# EAGLE board main (EAGLE 6.1)
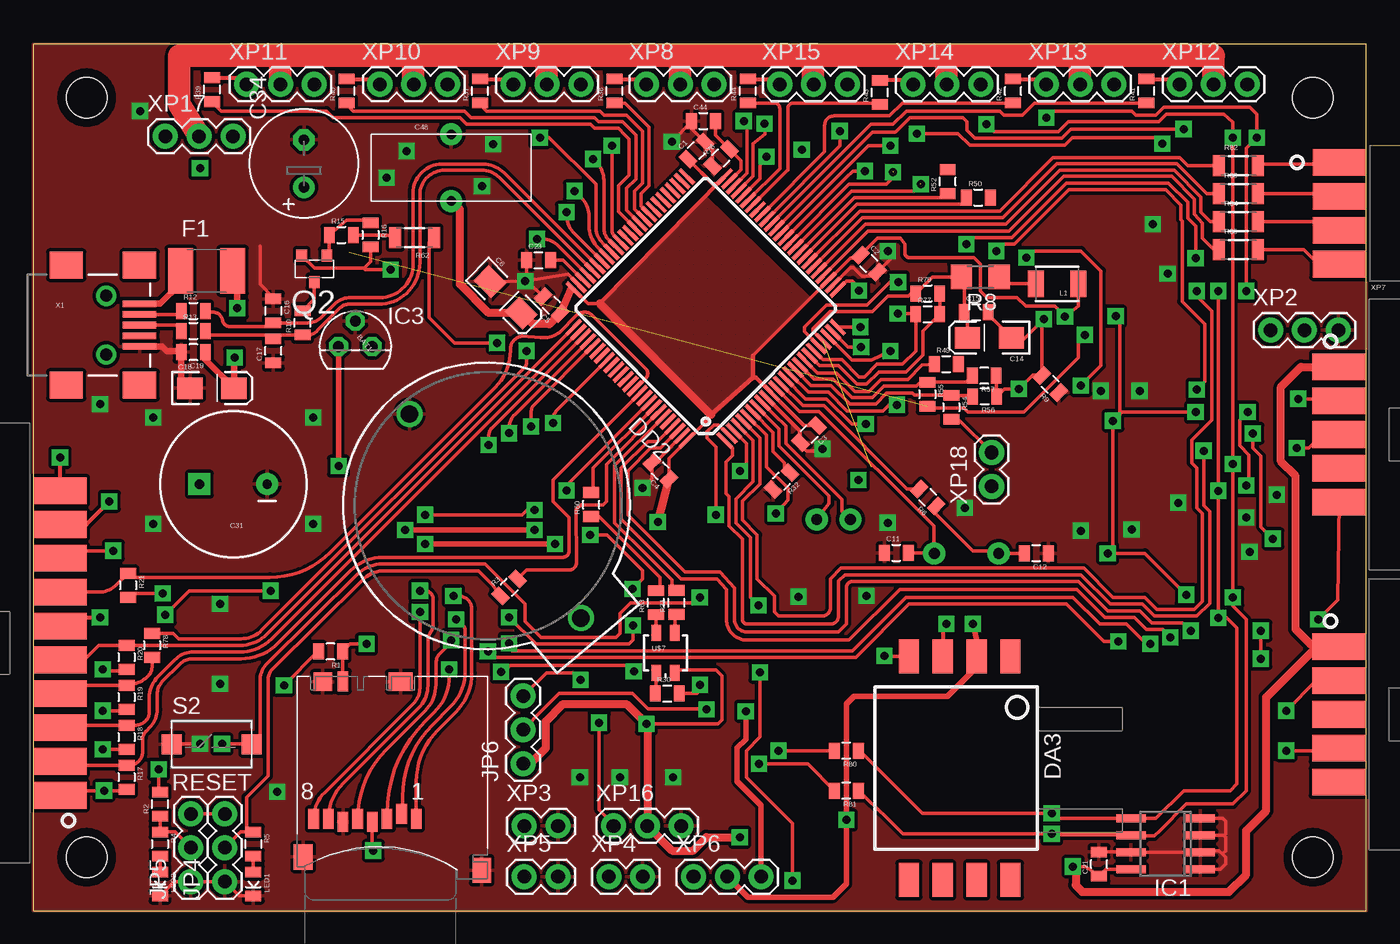
[diagram p3: board, top side]
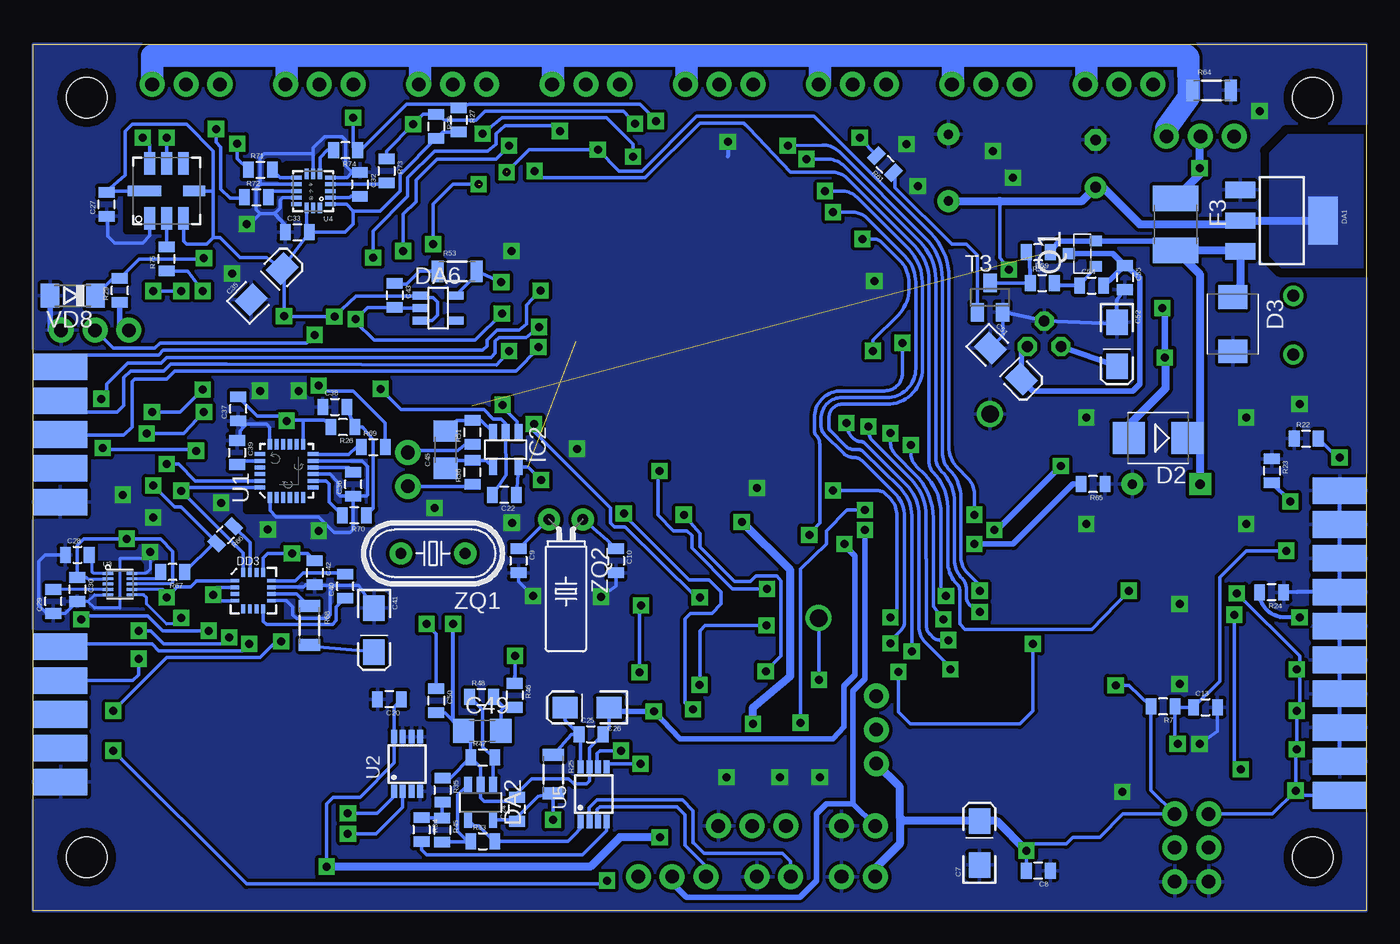
[diagram p4: board, bottom side, seen from below]

Size 100 x 65 mm. Coordinates in mm from the lower left corner, seen from the top.
Outline: 0,0 100,0 100,65 0,65 0,0
Copper layers (1*16): Top 0.035mm / dielectric 1.5mm / Bottom 0.035mm
Design rules "default": minimum track width 0.5mm, minimum drill 0.3mm, track to track 0.18mm, track to pad 0.15mm, pad to pad 0.15mm, via to via 0.15mm, smd to smd 0.15mm, copper to edge 0mil, drill to drill 30mil, minimum pad ring 12mil, minimum via ring 12mil, stop-mask expansion 4mil, vias tented up to drill 0mil, thermal gap 10mil
tKeepout: area 75.5,10 to 89.7,18.5
bRestrict: area 77,52 to 81,56; area 87,51 to 93,57; area 78,30 to 84,36; area 81.5,22 to 85.5,26; area 92,23 to 95,26; 6 lines

## Footprints (pad centres in the part's own frame; a part is rotated, then mirrored left to right if it is on the bottom)
BATTCOM_20MM_PTH = drill 1.3: 1 20,0; 2 0,0
0805 = smd 0.8 x 1.2: 1 -0.9,0; 2 0.9,0
EIA3216-KIT = smd 1.9 x 1.6: A 1.65,0; C -1.65,0
CPOL-RADIAL-1000UF-25V = drill 0.7 pad 1.651 square: 1 2.54,0 | drill 0.7 pad 1.651: 2 -2.54,0
E3,5-8 = drill 0.813 pad 1.6: + -1.778,0 | drill 0.813 pad 1.6 octagon: - 1.778,0
1206 = smd 1.6 x 1.8: 1 -1.4,0; 2 1.4,0
CAP-IONISTOR-5MM = drill 0.7 pad 1.651: 1 -2.5,0; 2 2.5,0
C1206 = smd 1.6 x 1.8: 1 -1.4,0; 2 1.4,0
SMB = smd 2.4 x 2.4: A 2.2,0; C -2.2,0
SMBJ = smd 1.78 x 2.16: A 2.04,0; C -2.03,0
SOT223 = smd 1.219 x 2.235: 1 -2.311,-3.099; 2 0,-3.099; 3 2.311,-3.099 | smd 3.6 x 2.2: 4 0,3.099
SOT23-5 = smd 0.6 x 1.2: 1 -0.95,-1.306; 2 0,-1.306; 3 0.95,-1.306; 4 0.95,1.306; 5 -0.95,1.306
482 = smd 2.54 x 1.524: 1 -7.62,3.81; 2 -7.62,1.27; 3 -7.62,-1.27; 4 -7.62,-3.81; 5 9.144,-3.81; 6 9.144,-1.27; 7 9.144,1.27; 8 9.144,3.81
MICROSD = smd 0.8 x 1.5: 1 -1.94,2.7; 2 -0.84,2.3; 3 0.26,2.7; 4 1.36,2.9; 5 2.46,2.7; 6 3.56,2.9; 7 4.66,2.7; 8 5.76,2.7; 13 3.56,-7.641 | smd 1.4 x 1.9: 9 6.55,5.55; 10 -6.85,6.55 | smd 1.8 x 1.4: 11 -0.75,-7.6 | smd 1.4 x 1.4: 12 5.077,-7.6
TQFP100 = smd 1.5 x 0.3: 1 -8,6; 2 -8,5.5; 3 -8,5; 4 -8,4.5; 5 -8,4; 6 -8,3.5; 7 -8,3; 8 -8,2.5; 9 -8,2; 10 -8,1.5; 11 -8,1; 12 -8,0.5; 13 -8,0; 14 -8,-0.5; 15 -8,-1; 16 -8,-1.5; 17 -8,-2; 18 -8,-2.5; 19 -8,-3; 20 -8,-3.5; 21 -8,-4; 22 -8,-4.5; 23 -8,-5; 24 -8,-5.5; 25 -8,-6; 51 8,-6; 52 8,-5.5; 53 8,-5; 54 8,-4.5; 55 8,-4; 56 8,-3.5; 57 8,-3; 58 8,-2.5; 59 8,-2; 60 8,-1.5; 61 8,-1; 62 8,-0.5; 63 8,0; 64 8,0.5; 65 8,1; 66 8,1.5; 67 8,2; 68 8,2.5; 69 8,3; 70 8,3.5; 71 8,4; 72 8,4.5; 73 8,5; 74 8,5.5; 75 8,6 | smd 0.3 x 1.5: 26 -6,-8; 27 -5.5,-8; 28 -5,-8; 29 -4.5,-8; 30 -4,-8; 31 -3.5,-8; 32 -3,-8; 33 -2.5,-8; 34 -2,-8; 35 -1.5,-8; 36 -1,-8; 37 -0.5,-8; 38 0,-8; 39 0.5,-8; 40 1,-8; 41 1.5,-8; 42 2,-8; 43 2.5,-8; 44 3,-8; 45 3.5,-8; 46 4,-8; 47 4.5,-8; 48 5,-8; 49 5.5,-8; 50 6,-8; 76 6,8; 77 5.5,8; 78 5,8; 79 4.5,8; 80 4,8; 81 3.5,8; 82 3,8; 83 2.5,8; 84 2,8; 85 1.5,8; 86 1,8; 87 0.5,8; 88 0,8; 89 -0.5,8; 90 -1,8; 91 -1.5,8; 92 -2,8; 93 -2.5,8; 94 -3,8; 95 -3.5,8; 96 -4,8; 97 -4.5,8; 98 -5,8; 99 -5.5,8; 100 -6,8
16LPCC = smd 0.65 x 0.28: 1 -1.37,0.75; 2 -1.37,0.25; 3 -1.37,-0.25; 4 -1.37,-0.75; 9 1.37,-0.75; 10 1.37,-0.25; 11 1.37,0.25; 12 1.37,0.75 | smd 0.28 x 0.65: 5 -0.75,-1.37; 6 -0.25,-1.37; 7 0.25,-1.37; 8 0.75,-1.37; 13 0.75,1.37; 14 0.25,1.37; 15 -0.25,1.37; 16 -0.75,1.37
1812 = smd 1.9 x 3.4: 1 -1.95,0; 2 1.95,0
SO-08 = smd 0.6 x 2.2: 1 -1.905,-2.6; 2 -0.635,-2.6; 3 0.635,-2.6; 4 1.905,-2.6; 5 1.905,2.6; 6 0.635,2.6; 7 -0.635,2.6; 8 -1.905,2.6
TO92 = drill 0.813 octagon: 1 -1.27,0; 2 0,1.905; 3 1.27,0
2X5-PSEUDOSMD = smd 4 x 2: 1 0,5.08; 3 0,2.54; 5 0,0; 7 0,-2.54; 9 0,-5.08 | smd 4 x 2 bottom: 2 0,5.08; 4 0,2.54; 6 0,0; 8 0,-2.54; 10 0,-5.08
STAND-OFF-TIGHT = hole 3.048: 0,0
1X03 = drill 1.016 pad 1.88: 1 0,0; 2 2.54,0; 3 5.08,0
1210 = smd 1.2 x 2: 1 -1.6,0; 2 1.6,0
LED-0805 = smd 0.8 x 1.2: A -0.9,0; C 0.9,0
MICRO3 = smd 0.8 x 0.9: 1 -0.95,-1; 2 0.95,-1; 3 0,1
R1206 = smd 1.6 x 1.803: 1 -1.422,0; 2 1.422,0
R1206' = smd 0.9 x 1.6: 1 -1.45,0; 2 1.45,0
BUTTON_6X3.5 = smd 1.5 x 1.5: P 0,-1.75; S 6,-1.75
SOT23 = smd 1 x 1.4: 1 -0.95,-1.1; 2 0.95,-1.1; 3 0,1.1
QFN-24 = smd 0.8 x 0.3: 1 -2,1.25; 2 -2,0.75; 3 -2,0.25; 4 -2,-0.25; 5 -2,-0.75; 6 -2,-1.25; 13 2,-1.25; 14 2,-0.75; 15 2,-0.25; 16 2,0.25; 17 2,0.75; 18 2,1.25 | smd 0.3 x 0.8: 7 -1.25,-2; 8 -0.75,-2; 9 -0.25,-2; 10 0.25,-2; 11 0.75,-2; 12 1.25,-2; 19 1.25,2; 20 0.75,2; 21 0.25,2; 22 -0.25,2; 23 -0.75,2; 24 -1.25,2
MSOP8 = smd 1 x 0.45: 1 -2.05,0.975; 2 -2.05,0.325; 3 -2.05,-0.325; 4 -2.05,-0.975; 5 2.05,-0.975; 6 2.05,-0.325; 7 2.05,0.325; 8 2.05,0.975
DFN-10 = smd 0.8 x 0.22: 1 -0.91,0.8; 2 -0.91,0.4; 3 -0.91,0; 4 -0.91,-0.4; 5 -0.91,-0.8; 6 0.91,-0.8; 7 0.91,-0.4; 8 0.91,0; 9 0.91,0.4; 10 0.91,0.8
QFN-16_0.5MM = smd 0.8 x 0.3: 1 -1.275,1; 2 -1.275,0.5; 3 -1.275,0; 4 -1.275,-0.5; 5 -1.275,-1; 9 1.275,-1; 10 1.275,-0.5; 11 1.275,0; 12 1.275,0.5; 13 1.275,1 | smd 0.3 x 0.8: 6 -0.5,-1.275; 7 0,-1.275; 8 0.5,-1.275; 14 0.5,1.275; 15 0,1.275; 16 -0.5,1.275
BMP085 = smd 1.67 x 0.8: 1 -2.065,1.27; 2 -2.065,0; 3 -2.065,-1.27; 5 2.065,-1.27; 6 2.065,0; 7 2.065,1.27 | smd 0.8 x 1.67: 4 0,-2.065 | smd 0.8 x 2.5: 8 0,1.65
LED-TRICOLOR-SMD = smd 0.7 x 1.2: A 0.7,-1.5; B 0.7,1.5; G -0.7,1.5; R -0.7,-1.5
SOD80C = smd 1.4 x 1.8: A 1.7,0; C -1.7,0
USB-MINIB-NOSTOP = smd 2.5 x 0.5: D+ 2.5,0; D- 2.5,0.8; GND 2.5,-1.6; ID 2.5,-0.8; VBUS 2.5,1.6 | smd 2.5 x 2: G1 -3,-4.5; G2 -3,4.5; G3 2.5,4.5; G4 2.5,-4.5 | drill 0.9 pad 0.8: H1 0,2.2 | drill 0.9 pad 0.787: H2 0,-2.2
2X10-PSEUDOSMD = smd 4 x 2: 1 0,11.43; 3 0,8.89; 5 0,6.35; 7 0,3.81; 9 0,1.27; 11 0,-1.27; 13 0,-3.81; 15 0,-6.35; 17 0,-8.89; 19 0,-11.43 | smd 4 x 2 bottom: 2 0,11.43; 4 0,8.89; 6 0,6.35; 8 0,3.81; 10 0,1.27; 12 0,-1.27; 14 0,-3.81; 16 0,-6.35; 18 0,-8.89; 20 0,-11.43
1X02 = drill 1.016 pad 1.88: 1 0,0; 2 2.54,0
1X4-PSEUDOSMD = smd 4 x 2: 1 -3.81,5.08; 2 -3.81,2.54; 3 -3.81,0; 4 -3.81,-2.54
HC49U-V = drill 0.813 pad 1.676: 1 -2.413,0; 2 2.413,0
TC38H = drill 0.813 pad 1.676: 1 -1.27,0; 2 1.27,0

## Placement (x,y rotation side)
BAT1  3V  [BATTCOM_20MM_PTH]  28.22,37.26 310 top
C1  0.1uF  [0805]  49.75,57.02 45 top
C2  0.1uF  [0805]  62.69,48.55 315 top
C3  0.1uF  [0805]  58.2,35.75 225 top
C4  0.1uF  [0805]  47.05,33 135 top
C5  0.1uF  [0805]  38.87,45.43 135 top
C6  10uF/6.3v  [EIA3216-KIT]  35.42,46.01 315 top
C7  47uF/6.3v  [EIA3216-KIT]  29.01,5.07 90 bottom
C8  0.1uF  [0805]  24.6,3 180 bottom
C9  10pF  [0805]  63.6,26.25 270 bottom
C10  10pF  [0805]  56.3,26.25 270 bottom
C11  20pF  [0805]  64.75,26.85 0 top
C12  20pF  [0805]  75.25,26.8 180 top
C13  0.1uF  [0805]  12.05,15.25 0 bottom
C14  10uF/6.3v  [EIA3216-KIT]  71.73,42.98 180 top
C15  0.1uF  [0805]  70.74,44.89 0 top
C16  20pF  [0805]  18,45 270 top
C17  20pF  [0805]  18,42 90 top
C18  10uF/6.3v  [EIA3216-KIT]  13.4,39.2 0 top
C19  0.1uF  [0805]  12,41.9 180 top
C20  0.1uF  [0805]  73.28,15.85 180 bottom
C21  0.1uF  [0805]  79.96,3.5 90 top
C22  0.1uF  [0805]  64.65,31.2 180 bottom
C23  2.2uF  [0805]  37.9,48.8 0 top
C24  0.1uF  [0805]  63.71,7.6 90 bottom
C25  0.1uF  [0805]  58.16,13.23 0 bottom
C26  4.7uF  [EIA3216-KIT]  58.46,15.23 180 bottom
C27  0.1uF  [0805]  94.5,53 90 bottom
C28  0.1uF  [0805]  96.7,26.7 0 bottom
C29  0.1uF  [0805]  98.5,23.2 90 bottom
C30  1uF  [0805]  96.7,24.1 270 bottom
C31  330uF/16v  [CPOL-RADIAL-1000UF-25V]  15,32 180 top
C32  0.1uF  [0805]  75.5,54.5 270 bottom
C33  0.1uF  [0805]  80.2,50.9 0 bottom
C34  560uF/4v  [E3,5-8]  20.3,56.05 90 top
C35  4.7uF  [EIA3216-KIT]  82.5,47 45 bottom
C36  0.1uF  [0805]  76,32 90 bottom
C37  0.1uF  [0805]  84.63,37.65 90 bottom
C38  0.1uF  [0805]  77.38,37.8 0 bottom
C39  2.2nF/50v  [0805]  84.72,34.37 270 bottom
C40  0.22uF  [0805]  76.6,24.34 90 bottom
C41  4.7uF  [EIA3216-KIT]  74.44,21.04 270 bottom
C42  0.1uF  [0805]  78.88,25.36 270 bottom
C43  0.1uF  [0805]  72.88,46.16 270 bottom
C44  2.2uF  [0805]  50.28,59.24 0 top
C45  10uF  [1206]  69.06,34.58 90 bottom
C48  0.22F/5.5v  [CAP-IONISTOR-5MM]  31.35,55.75 90 top
C49  2.2uF  [C1206]  66.32,13.47 0 bottom
C50  0.1uF  [0805]  69.77,15.74 270 bottom
C51  10uF/16v  [EIA3216-KIT]  27.02,41.05 315 bottom
C52  10uF/6.3v  [EIA3216-KIT]  18.7,42.5 270 bottom
C54  0.1uF  [0805]  20.6,46.9 0 bottom
C55  0.1uF  [0805]  18.1,47.5 270 bottom
D2  10BQ060  [SMB]  15.62,35.46 180 bottom
D3  SM6T12V  [SMBJ]  10,44 270 bottom
DA1  LM1117  [SOT223]  6.34,51.77 270 bottom
DA2  LMV321M5  [SOT23-5]  66.44,8.12 180 bottom
DA3  MPXV5010DP  [482]  69.5,11.44 270 top
DA6  LP2980  [SOT23-5]  69.63,45.21 270 bottom
DD1  MICROSD_SDIO  [MICROSD]  26.79,9.57 180 top
DD2  STM32F103VDT6  [TQFP100]  50.45,45.18 135 top
DD3  HMC5883L  [16LPCC]  83.5,24 0 bottom
F1  POLYSWITCH  [1812]  13,48 0 top
F3  POLYSWITCH  [1812]  14.3,51.5 270 bottom
IC1  24AA32ASN  [SO-08]  84.96,5 90 top
IC2  INA194  [SOT23-5]  64.56,34.58 180 bottom
IC3  LP2950Z  [TO92]  24.16,42.32 0 top
JP1  2X5  [2X5-PSEUDOSMD]  97.97,35.72 0 top
JP2  2X5  [2X5-PSEUDOSMD]  97.95,14.72 0 top
JP3  STAND-OFFTIGHT  [STAND-OFF-TIGHT]  4,4 0 top
JP4  boot_0  [1X03]  14.36,2.17 90 top
JP5  boot_1  [1X03]  11.82,2.17 90 top
JP6  bat  [1X03]  36.75,11.02 90 top
JP7  STAND-OFFTIGHT  [STAND-OFF-TIGHT]  96,61 0 top
JP8  STAND-OFFTIGHT  [STAND-OFF-TIGHT]  96,4 0 top
JP9  STAND-OFFTIGHT  [STAND-OFF-TIGHT]  4,61 0 top
L1  1uH  [1210]  76.8,47.03 180 top
LED1  RED  [LED-0805]  16.5,2 270 top
LED2  RED  [LED-0805]  9.5,2 270 top
Q1  IRLML5203  [MICRO3]  21.3,49.3 90 bottom
Q2  IRLML5103  [MICRO3]  21.08,48.16 180 top
R1  10k  [0805]  22.3,19.43 180 top
R2  10k  [0805]  9.5,8 90 top
R3  10k  [0805]  35.7,24.25 45 top
R4  100  [0805]  9.5,5 270 top
R5  100  [0805]  16.5,5 270 top
R6  330  [0805]  67.1,31 135 top
R7  10k  [0805]  15.25,15.3 180 bottom
R8  2.2  [R1206]  71.05,47.55 180 top
R9  0  [0805]  76.3,39.5 135 top
R10  1.5k  [0805]  20.2,44.1 90 top
R12  33  [0805]  12,45 0 top
R13  33  [0805]  12,43.5 0 top
R15  2.7k  [0805]  23.1,50.7 0 top
R16  10k  [0805]  25.3,50.7 270 top
R17  10k  [0805]  7,10 270 top
R18  10k  [0805]  7,13 270 top
R19  10k  [0805]  7,16 270 top
R20  10k  [0805]  7,19 270 top
R21  10k  [0805]  7.1,24.4 270 top
R22  10k  [0805]  4.5,35.42 0 bottom
R23  10k  [0805]  7.08,33 270 bottom
R24  10k  [0805]  7.1,23.88 180 bottom
R25  2.2  [R1206']  60.99,10.23 270 bottom
R26  1  [0805]  76.78,36.28 180 bottom
R27  2.7k  [0805]  68.08,59.32 270 bottom
R28  2.7k  [0805]  69.78,58.85 270 bottom
R29  1k  [0805]  93.52,46.53 90 bottom
R30  68  [0805]  47.55,16.29 0 top
R31  0  [0805]  48.25,23.12 90 top
R32  100k  [0805]  56.13,32.22 225 top
R33  100k  [0805]  66.28,5.2 0 bottom
R34  30k  [0805]  70.87,6.07 270 bottom
R35  1.5k  [0805]  69.3,9.03 270 bottom
R36  47  [0805]  67.06,32.88 90 bottom
R37  330  [0805]  33.5,61.5 90 top
R38  330  [0805]  43.6,61.5 90 top
R39  330  [0805]  13.4,61.6 90 top
R40  330  [0805]  23.5,61.5 90 top
R41  330  [0805]  83.5,61.5 90 top
R42  330  [0805]  73.5,61.5 90 top
R43  330  [0805]  63.5,61.4 90 top
R44  330  [0805]  53.6,61.5 90 top
R45  10k  [0805]  69.32,6.04 270 bottom
R46  1k  [0805]  63.88,16.15 270 bottom
R47  100k  [0805]  66.28,11.48 0 bottom
R48  10k  [0805]  66.37,16.03 0 bottom
R49  330  [0805]  68.5,41 0 top
R50  330  [0805]  70.9,53.5 0 top
R51  47  [0805]  67.06,35.88 90 bottom
R52  330  [0805]  68.6,54.7 90 top
R53  2.2  [R1206']  68.21,47.97 0 bottom
R54  10k  [0805]  68.87,37.76 270 top
R55  10k  [0805]  67.07,38.74 270 top
R56  1k  [0805]  71.37,38.58 180 top
R57  1k  [0805]  71.35,40.13 180 top
R58  1k  [0805]  24.3,47.1 0 bottom
R59  10k  [0805]  24.6,49.4 180 bottom
R60  0  [0805]  41.85,30.46 90 top
R61  1k  [0805]  36.1,56 135 bottom
R62  0  [R1206']  28.6,50.5 180 top
R63  68  [0805]  46.7,23.1 90 top
R64  0  [R1206']  11.6,61.55 0 bottom
R65  0  [0805]  20.5,32 180 bottom
R66  1k  [0805]  85.6,28.2 225 bottom
R67  1k  [0805]  89.55,25.4 180 bottom
R68  0  [R1206']  79.29,21.39 270 bottom
R69  1k  [0805]  74.5,34.77 0 bottom
R70  0  [0805]  75.9,29.65 180 bottom
R71  1k  [0805]  82.96,55.59 0 bottom
R72  1k  [0805]  83.27,53.52 0 bottom
R73  0  [0805]  73.5,55.5 270 bottom
R74  0  [0805]  76.57,57.04 180 bottom
R75  1k  [0805]  90,48.9 90 bottom
R76  0  [0805]  51.59,56.49 45 top
R77  0  [0805]  67.1,44.75 0 top
R78  0  [0805]  8.9,19.9 270 top
R79  0  [0805]  67.1,46.3 0 top
R80  0  [0805]  61,12 180 top
R81  0  [0805]  61,9 180 top
R82  0  [R1206']  90.4,55.9 0 top
R83  0  [R1206']  90.4,53.8 0 top
R84  0  [R1206']  90.4,51.7 0 top
R85  0  [R1206']  90.4,49.6 0 top
S2  RESET  [BUTTON_6X3.5]  10.39,14.23 0 top
T3  BC848  [SOT23]  28.22,46 0 bottom
U1  ITG-3200  [QFN-24]  81,33 90 bottom
U2  TMP75DGK  [MSOP8]  71.96,11 90 bottom
U3  MAG3110  [DFN-10]  93.5,24.5 0 bottom
U4  MMA8451Q  [QFN-16_0.5MM]  79,54 180 bottom
U5  MAX1236EUA+  [MSOP8]  57.96,8.73 90 bottom
U44  BMP085  [BMP085]  90,54 90 bottom
U$7  LED-TRICOLOR  [LED-TRICOLOR-SMD]  47.43,19.33 0 top
VD8  BZV55-C3V3  [SOD80C]  97.04,46.13 180 bottom
X1  USB-SMD-NS  [USB-MINIB-NOSTOP]  5.47,43.93 0 top
XP1  2X10-PSEUDO_SMD  [2X10-PSEUDOSMD]  2,20.08 180 top
XP2  RECEIVER  [1X03]  92.83,43.55 0 top
XP3  EXT_5V  [1X02]  36.83,6.35 0 top
XP4  an2_5v  [1X02]  43.18,2.54 0 top
XP5  EXT3.3V  [1X02]  36.83,2.54 0 top
XP6  sonar  [1X03]  49.53,2.54 0 top
XP7  SPI_EXT  [1X4-PSEUDOSMD]  101.8,51.05 0 top
XP8  PWM1  [1X03]  46,62 0 top
XP9  PWM2  [1X03]  36,62 0 top
XP10  PWM3  [1X03]  26,62 0 top
XP11  PWM4  [1X03]  16,62 0 top
XP12  PWM5  [1X03]  86,62 0 top
XP13  PWM6  [1X03]  76,62 0 top
XP14  PWM7  [1X03]  66,62 0 top
XP15  PWM8  [1X03]  56,62 0 top
XP16  tacho  [1X03]  43.53,6.35 0 top
XP17  power  [1X03]  9.9,58.1 0 top
XP18  current_sens  [1X02]  71.9,31.83 90 top
ZQ1  8M  [HC49U-V]  70.01,26.8 180 bottom
ZQ2  32k  [TC38H]  60.04,29.35 180 bottom

## Tracks (layer width: path | path; a pad name or v marks a point on that pad's centre or on a via)
3.3V  (via drill 0.6)
  Top 0.25: IC1.8 80.45,3.1 C21.1 | 25.43,4.57 DD1.4 | DD2.75 | 46.07,13.93 v46,14 51.35,14 51.65,14.3 51.65,17.6 51.2,18.05 48.35,18.05 U$7.A | v46.85,29.15 47,29 | JP6.1 36.75,11.25
  Top 0.254: JP5.3 JP4.3 | R17.2 6.9,9 v5.3,9 2.35,9 XP1.2 | v5.2,12.1 R18.2 | R19.2 7,15 v5.2,15 | R20.2 7,18 5.3,18 v5.2,18.1 | v9.7,23.8 7.3,23.8 R21.2 | 50.5,36.74 DD2.100 47.69,33.93 C4.1 | 54,41.66 DD2.28 59.66,47.3 61.32,48.96 61.83,48.96 C2.1 63.32,50.45 65.05,50.45 65.4,50 65.4,49.32 arc90 65.72,49 70.55,49 71.05,48.5 71.05,46.5 71.55,46 73.8,46 74.45,45.35 76.64,45.35 v77.41,44.58 78.4,45.37 L1.1 | C3.1 58.84,36.26 | R1.2 21.33,19.43 v18.8,16.9 | C1.1 50.16,55.34 | v93,27.9 92.1,28.8 92.1,34.1 91.5,34.7 v91.5,35.8 | 81,36.7 81,27.2 v80.6,26.8 83.4,26.8 v86.5,23.7 | C21.1 78.96,3.3 v78,3.3 | 42.51,45.55 41.6,45.55 DD2.75 | 81,36.7 v81,36.75 81.65,37.4 v87.2,37.4 | 81,36.7 81.5,37.2 81.5,44.3 v81.2,44.6 | Q2.2 21.09,48.2 24.8,48.2 | 24.8,48.2 24.9,48.1 v26.8,48.1 | R16.2 25.3,48.7 24.8,48.2
  Top 0.3: 54.22,40 DD2.11
  Top 0.305: DD2.11 57.78,36.44 C3.1 | 50.16,55.34 51,54.5 51.28,54.5 DD2.50 42.51,45.57
  Top 0.35: 50.5,36.74 50.85,37.2 50.8,37.2 54,40 | 42.51,45.55 42.51,45.57 | 54,40 54.22,40 | 54,40 54,41.66 | DD2.75 40.31,46.59
  Top 0.406: v25.5,4.5 25.43,4.57
  Top 0.61: 50.85,37.2 42.51,45.55 | 40.31,46.59 C5.1 38.71,44 37.5,44 36.66,44.84 C6.A 34.16,44.84 32,47 32,52.6 C48.1 | 46.07,13.93 XP16.2 47.92,4.5 49.5,4.5 50.5,5.5 v53,5.5 | v46.85,29.15 C4.1 | v46,14 44.5,15.5 39.75,15.5 38.45,14.2 38.45,12.2 37.27,11.02 JP6.1 | v78,3.3 78.2,3.3 78.2,1.9 78.7,1.4 89.7,1.4 91,2.7 91,6 92.5,7.5 92.5,16 96.3,19.8 JP2.1 97.7,20 95.8,20 94.7,21.1 94.7,32.6 93.6,33.7 93.6,39.3 95.1,40.8 JP1.1
  Bottom 0.22: U3.2 95.9,24.9 96,25 C30.1 | U3.8 89.7,24.5 89.55,24.65
  Bottom 0.25: DD3.13 82.75,26.45 82.42,26.78 | 79.4,26.78 C42.1 | DD3.2 86.25,24.25 86.5,24 v86.5,23.7 | 86.5,23.5 86.25,23.25 DD3.4 | U4.14 79.5,51.1 C33.2 76.6,50.9 76,51.5 76,52.5 76.5,53 U4.1 | U44.8 94.4,54 arc-90 C27.2 94.5,54 93.1,55.2 93.1,58.5 92.6,59 88.5,59 86.5,57 86.5,54 | U44.3 88.73,50.23 88.5,50 87,50 86.5,50.5 86.5,54 | 86.5,54 U44.4 | C8.2 v25.5,4.5 25.43,4.57 | C30.1 96.7,27.4 96.2,27.9 v93,27.9 90.44,27.9 89.55,26.93 89.55,24.65 | 25.43,4.57 25.43,5 | 25.43,4.57 25,5 22.5,5 22,5.5 20,5.5 18.25,7.25 JP4.3 16.15,9.04 R7.2 17.79,16.9 v18.8,16.9
  Bottom 0.254: JP5.3 7.05,7.25 v5.3,9 | v5.3,9 5.3,12 v5.2,12.1 v5.2,15 5,15 5,17.9 v5.2,18.1 5.1,18.1 5,18 5,19.1 v9.7,23.8 | XP1.2 4.95,8.65 v5.3,9 | R27.2 69.31,58.42 R28.2 72.5,55.23 72.5,54 74,52.5 76,52.5 | C35.A 79.3,50.87 C33.2 | C35.A 82.5,49 84.5,49 86,50.5 86.5,50.5 | 79.75,36.8 U1.13 | R26.2 78.2,36.8 79.75,36.8 | DA6.3 70.09,44.26 69.65,44.7 69.65,45.65 70,46 70.78,46 DA6.1 70.9,46.1 75.8,46.1 v77.41,44.59 v77.41,44.58 80.78,44.58 v81.2,44.6 81.2,48.03 C35.A | 79.75,36.8 80.95,36.8 v81,36.75 81.35,37.1 83.2,37.1 84.63,38.53 C37.2 | v26.8,48.1 27.5,49 27.5,53.25 | 79.4,26.78 79.42,26.8 v80.6,26.8 82.4,26.8 82.42,26.78 | v86.5,23.7 86.5,23.5 | C20.1 72.94,15.29 U2.8 72.94,11.06 75.5,8.5 77.5,8.5 78,8 v78,3.3 | v91.5,35.8 88.7,35.8 v87.2,37.4
  Bottom 0.61: DA1.4 DA1.2 9.71,51.5 17,51.5 19.77,54.27 C34.+ 21.32,53.25 27.5,53.25 C48.1 | v46.85,29.15 43.2,25.55 43.2,17.6 46,15.25 v46,14 | v78,3.3 58.2,3.3 56,5.5 v53,5.5 | JP6.1 35,9.27 35,7 | 35,7 35,5 36.83,3.17 XP5.1 | v25.5,4.5 27.72,6.72 C7.A 34.72,6.72 35,7
  pour Bottom (no thermals, hatched): 0,58.5 6,58.5 7.5,57 7.5,49 6.5,48 0,48
  pour Top (hatched): 42.4,45.4 50.5,53.4 58.1,46 54,42 54,40 50.8,37.1
5V  (via drill 0.6)
  Top 0.406: v70.5,21.5 71,19.29 DA3.2 71,18.83 71,18.5 68.57,16.07 61.57,16.07 61,15.5 v61,6.8 61,2 60,1 53.61,1 XP6.2 | IC3.1 22.89,36.11 22.9,36.1 v22.9,33.35 | v37.6,28.55 v27.9,28.55
  Bottom 0.25: 62.13,8.58 R25.2 61,8.57 v61,6.8
  Bottom 0.254: DA2.5 63.82,6.81 C24.1 63.71,7 62.13,8.58 | C50.1 69.77,20.77 v70.5,21.5
  Bottom 0.406: IC3.1 C52.A | XP6.2 52.07,2.07 51,1 42.5,1 41.25,2.25 41.25,7.25 40.5,8 38.52,8 38.5,8.02 | v22.9,33.35 27.7,28.55 v27.9,28.55 | v37.6,28.55 37.6,17.4 38.5,16.5 38.5,8.02 | XP3.1 38.5,8.02
5V_DOMAIN_ENABLE  (via drill 0.6)
  Top 0.25: DD2.67 42.74,50.06 arc-45 42.2,51.36 42.2,54.5 38.7,58 v38,58
  Bottom 0.25: v38,58 R61.2
5V_USB  (via drill 0.6)
  Top 0.25: v15.3,45.2 15.5,45
  Top 0.5: C19.1 12.9,41.35 C18.A 15.05,41.45 v15.1,41.5 | F1.2 15.3,48 v15.3,45.2
  Bottom 0.5: v15.3,45.2 15.1,45 v15.1,41.5
  Bottom 0.61: D2.A 17.82,36.43 C18.A 15.05,41.45 v15.1,41.5
6V  (via drill 0.6)  (1 unrouted)
  Top 0.254: v78.9,43.2 78.4,42.7 78.4,41.5 74.3,37.4 70.1,37.4 69.8,37.7 67.21,37.7 R55.2
  Bottom 0.254: XP2.2 94.02,42.2 90.9,42.2 90.5,42.6 79.5,42.6 v78.9,43.2
  Bottom 0.406: F3.2 15,50.25 Q1.2 23.05,50.25 R59.1
  Bottom 0.61: 10.05,49.55 F3.2 12.46,47.71 12.46,35 | DA1.3 9.44,46.59 | C31.1 12.46,35 | D2.C 12.92,35.46 12.46,35
  Bottom 1.016: 10.05,49.55 DA1.3 | 9.44,46.59 D3.C
AN5V_0
  Bottom 0.25: 59.4,5.7 58.94,6.17 U5.1
  Bottom 0.254: DA2.4 66.93,6.35 66.6,6.35 65.45,5.2 R33.2 59.9,5.2 59.4,5.7
AN5V_1
  Bottom 0.25: U5.2 58.3,6.7 58.3,7.7 57.7,8.3 56.4,8.3 | XP4.1 43.18,3.68 43.8,4.3 49.7,4.3 50.4,5
  Bottom 0.254: 56.4,8.3 51.3,8.3 50.5,7.5 50.5,5.1 50.4,5
AN5V_2
  Bottom 0.25: U5.3 57.7,6.75 57.7,7.6 57.5,7.8 56.7,7.8 | 50.7,4.5 49.53,3.33 XP6.1
  Bottom 0.254: 56.7,7.8 51.7,7.8 51.1,7.2 51.1,4.9 50.7,4.5
AN5V_3/REF
  Bottom 0.254: R34.2 70.87,4.57 70.5,4.2 58.8,4.2 57,6 57,6.67 U5.4 56.95,6.64
BMP085_EOC  (via drill 0.6)
  Top 0.25: 54.3,24.9 54.3,28.2 53.2,29.3 53.2,30.72 54.5,32.02 54.5,35.47 DD2.5
  Top 0.254: DD2.5 53.28,36.67 | 54.3,24.9 55.6,23.6 55.6,22.4 55.9,22.1 59.18,22.1 arc90 59.8,22.72 59.8,24.89 60.61,25.7 78.8,25.7 81,23.5 83.4,23.5 84.3,22.6 87.1,22.6 87.7,23.2 87.7,29.8 87.3,30.2 87.3,33.2 86.9,33.6 86.9,35.3 88.4,36.8 88.4,45 87.3,46.1 v87.3,46.5
  Bottom 0.254: R75.1 88.4,48 v87.3,46.5
BOOT_0
  Top 0.25: 43,33.49 43,30.71 42.73,30.43 41.3,30.45 41.1,30.45 40.73,30.09 40.75,26.12 arc-90 40.18,25.55 37,25.55 R3.2
  Top 0.254: 43,33.49 DD2.94
BOOT_1  (via drill 0.6)
  Top 0.25: v17.8,24 11.7,24 v9.9,22.2 | v9.4,10.6 9.4,9 R2.2 | DD2.37 60.98,55 61.48,55.5 v62.4,55.5
  Top 0.254: DD2.37 56.48,50.48
  Bottom 0.25: 46.7,59.1 46.32,58.7 43.2,55.4 39.99,55.4 arc45 38.98,54.98 33.87,49.87 arc45 32.8,47.28 32.8,33.65 arc-45 32.48,32.88 arc45 31.4,30.27 31.4,26.22 arc-45 30.68,24.48 arc45 30.5,24.05 30.5,21.5 30.1,21.1 20.6,21.1 v17.8,24 | v9.9,22.2 9.9,11.2 v9.4,10.6 | 54.1,55 62.4,55 v62.4,55.5
  Bottom 0.254: 54.1,55 50,59.1 46.72,59.1 46.32,58.7
CURRENT_SENS  (via drill 0.6)
  Top 0.25: 59.65,38.9 58.14,38.9 DD2.15
  Top 0.254: DD2.15 56.87,40.23 56.87,40.18 | 59.65,38.9 61.05,37.5 63.75,37.5 64.2,37.95 v64.8,37.95
  Bottom 0.254: IC2.1 63.7,35.98 63.7,36.7 64.8,37.8 v64.8,37.95
FROM_GPS  (via drill 0.6)
  Top 0.25: v40,52.4 40,52.23 arc45 40.6,50.79 DD2.69
  Top 0.254: v83.8,20 83.5,20 82,21.5 80,21.5 78,23.5 65.45,23.5 61.45,19.5 35.9,19.5 v35.7,20.05
  Bottom 0.25: 33.8,47.16 arc-45 34.61,49.11 37.48,51.98 arc-45 38.49,52.4 v40,52.4
  Bottom 0.254: 97.7,20 JP2.2 96.5,19.8 96.3,20 91.1,20 90.6,19.5 84.3,19.5 v83.8,20 | v35.7,20.05 35.55,20.4 34.88,21.07 arc-45 34.65,21.62 34.65,29.57 arc-45 35.38,31.33 37.76,33.71 arc-45 38.47,34 38.48,34 arc45 39.19,34.29 40.64,35.74 arc45 40.9,36.37 40.9,36.94 arc90 39.34,38.5 35.96,38.5 arc-90 33.8,40.66 33.8,47.16
FROM_XBEE  (via drill 0.6)
  Top 0.254: DD2.26 61.01,47.25 61.46,47.25 61.95,46.76 v61.95,46.53
  Bottom 0.254: v61.95,46.53 62.58,45.9 62.58,45.87 63,45.45 63,44 63.55,43.55 65.2,43.55 65.95,42.8 65.95,42.35 66.3,42.05 90.25,42.05 90.6,41.7 96.97,41.7 97.07,41.6 | 97.07,41.6 96.1,41.6 | 97.07,41.6 97.44,41.23 JP1.2
GND  (via drill 0.6)
  Top 0.25: C21.2 82.33,4.4 IC1.7 IC1.2 87.69,4.5 88.96,4.5 89.21,4.25 | IC1.1 89.06,3.1 89.46,3.5 89.46,4 89.21,4.25 | 89.33,5.63 IC1.3 | 89.33,5.63 89.46,5.5 89.46,4.5 89.21,4.25 | IC1.4 89.25,6.91 89.45,6.7 89.45,5.76 89.33,5.63 | S2.P 10.41,12.5 v12.5,12.5 | v36.91,47.24 40.11,47.74 DD2.74
  Top 0.254: LED1.C 15.43,1.1 JP4.1 JP5.1 10.57,2.17 LED2.C | C16.1 18,46 17,47 17,49.85 | DD2.27 61.29,48.23 61.54,48.23 62.18,47.59 63,47.59 C2.2 64.38,48.97 v64.11,49.47 | C4.2 46.64,33.64 | v45.7,31.71 46.41,32.42 C4.2 | DD2.99 46.68,33.64 C4.2 | C23.1 37,47.33 v36.91,47.24 | C5.2 37.06,47.24 v36.91,47.24 | C6.C v36.91,47.24 | 47.9,57.76 v47.9,57.7 49.38,59.18 | 49.38,59.18 C44.1 | 49.38,59.18 49.38,58.66 C1.2 50.95,57.09 R76.1 | C3.2 57.56,34.94 58,34.5 59.06,34.5 v59.21,34.65
  Top 0.305: DD2.10 57.51,35.99 C3.2 | DD2.74
  Top 0.5: X1.GND 9.67,42.33 10,42 11,42 C19.2 11.1,39.85 C18.C
  Bottom 0.22: U3.5 95.4,23.7 95.9,23.2 | 95.9,23.2 C30.2 | U3.10 91.6,25.3 arc-34 91.24,25.62 v91.25,26.9 91.3,26.45 93.5,26.45 93.5,22.7 95.4,22.7 95.9,23.2
  Bottom 0.25: DD3.11 82.11,24.27 79.71,24.27 79.52,24.46 C42.2 78.82,24.4 77.75,24.4 | DD3.9 81.02,23.26 80.53,22.77 80.53,22.2 80.26,21.93 78.01,21.93 77.75,22.19 77.75,24.4 | U1.18 82.26,35.03 | U1.9 77.75,32.75 77.17,32.17 77.17,31.29 76.98,31.1 C36.1 | U1.11 75.35,33.75 74.93,33.33 | C36.1 75.73,31.1 | 82.23,30.98 U1.1 82.25,30.02 81.78,29.55 78.61,29.55 77.44,28.38 76.22,28.38 76,28.6 C36.1 | 81.2,51 C33.1 | C32.1 76.07,55.4 76.57,55.9 76.57,57.8 76.85,58.08 78.16,58.08 79,57.24 79,56.8 U4.7 | v12.5,12.5 11.15,13.45 C13.2 | v62.5,23.6 63.3,24.4 | C10.2 56.3,24.35 v57.4,23.55 | 75.6,24.4 77.75,24.4 | 97.6,22.3 C29.1 99,22.3 | 99.6,22.9 99.6,24.8
  Bottom 0.254: C51.C 27.27,43.13 T3.2 | C9.2 63.6,24.7 63.3,24.4 | 74.93,33.33 74.93,31.17 75,31.1 C36.1 | U4.5 76.47,55 76.07,55.4 | U4.12 81.3,53.5 81.5,53.3 81.5,52.7 81.9,52.3 83,52.3 | 83,52.3 83.3,52.6 83.3,54.2 83,54.5 | 83,54.5 83,56.5 82.7,56.8 79,56.8 | 83,54.5 U4.10 | 81.2,51.5 81.2,51 | C33.1 81.1,50.55 | 83,52.3 84.17,51.13 | 99.6,24.8 99.6,26.2 99.1,26.7 C28.1 | 99,22.3 99.6,22.9 | C30.2 97.6,22.3 | 82.26,35.03 82.26,36.26 82.5,36.5 84,36.5 84.25,36.25 | C39.1 84.5,35.49 84.5,36 84.25,36.25 | C41.C 75.6,24.4 | C37.1 84.63,36.63 84.25,36.25 | C27.1 94.4,52.1 94.4,50.6 93.9,50.1 91.8,50.1 91.27,50.63 U44.1
  Bottom 0.3: IC3.2 T3.2
  Bottom 0.305: IC3.2 18.82,44.02 C52.C 18.7,45.8 C55.2 | XP1.4 XP1.6 XP1.8 XP1.10 XP1.12 XP1.14 | XP1.20 XP1.18 XP1.16 XP1.14 | R24.1 5.19,23.89 XP1.14 | v47.9,57.7 47.9,56.6 | 81.9,52.3 81.2,51.5
  Bottom 0.406: XP2.3 98.74,43.55 VD8.A
  other vias: 8,60 33.65,54.35 34.5,57.5 28,57 26.5,55 85.1,47.8 84,51.5 41,10 44,10 48,10 80.1,39 83,39 64.1,29.1 69.9,30.2 78.6,28.5 82.4,28.6 85.9,30.6 91,29.5 93.3,31.2 18.3,8.9 21,37 21,29 9,29 9,37 5,38 14,23 14,17
  pour Bottom (hatched): 57.5,27.5 57.5,19 62.5,19 62.5,27.5
  pour Bottom (isolate 0.254, hatched): 0,65 100,65 100,0 0,0
  pour Top (isolate 0.254, hatched): 0,0 100,0 100,65 0,65
GND_A  (via drill 0.6)
  Top 0.25: 59.23,41.35 DD2.20
  Top 0.254: 59.23,41.35 60.65,41.35 61.95,40.05 62.35,40.05 63.3,41 65.2,41 66.2,42 R77.1 66.15,44.8 v64.85,44.8 | R57.1 72.27,40.11 R56.1 72.84,39.15 v73.95,39.15 75,40.2 75.4,40.2 R9.2 75.66,44.23 v75.81,44.38 74.23,42.8 73.56,42.8 C14.C 71.64,44.72 C15.2
  Bottom 0.254: C22.2 64.55,32.7 IC2.2 64.56,36.56 64.9,36.9 65.5,36.9 66.2,37.6 72.4,37.6 v73.95,39.15 | v75.81,44.38 75.69,44.26 | v64.85,44.8 66.85,42.8 74.45,42.8 75.81,44.16 v75.81,44.38 | v75.81,44.38 74.93,45.26 C43.2 72.83,45.21 DA6.2
GND_A_5V  (via drill 0.6)
  Top 0.305: v68.5,21.5 68.23,21.23 DA3.3
  Top 0.406: v29.4,27.5 v39.15,27.5 | XP6.3 54.61,7.39 54.6,7.4 54.6,7.9 52.8,9.7 52.8,12.2 53.45,12.85 v53.45,14.95
  Bottom 0.25: C26.C 56.81,13.68 C25.2 58.28,12.21 U5.7 58.28,9.71 58.5,9.5 59.45,9.5 59.85,9.9 62.61,9.9 | R47.1 67.18,12.93 C49.1
  Bottom 0.254: 62.61,9.9 63.71,8.8 C24.2 64.01,8.2 66.2,8.2 66.44,8.44 DA2.2 66.44,10.74 R47.1 68.73,9.93 R35.1 | C50.2 69.09,14.84 C49.1
  Bottom 0.305: C49.1 68.5,14.25 v68.5,21.5
  Bottom 0.406: R65.2 22,32 26.5,27.5 v29.4,27.5 | v53.45,14.95 56.48,14.95 C26.C | v53.45,14.95 53.5,15 | v53.45,14.95 51.5,12.9 40,12.9 39.2,13.8 39.2,16.85 38.35,17.7 38.35,26.6 39.15,27.4 v39.15,27.5
GPS_ENABLE  (via drill 0.6)
  Top 0.25: 53.8,23.5 53.8,28 52.7,29.1 52.7,30.89 54,32.19 54,35.27 DD2.4 | 54.5,17.86 v54.52,17.88 54.52,13.02 53.5,12 53.5,10 56.95,6.55 v56.95,2.25
  Top 0.254: JP2.7 97.72,12 v94,12 | DD2.4 52.96,36.34 | v54.4,22.9 53.8,23.5
  Bottom 0.25: v54.52,17.88 54.52,22.78 v54.4,22.9
  Bottom 0.254: v94,12 84,2 57.2,2 v56.95,2.25
GPS_PPS  (via drill 0.6)
  Top 0.25: 46.1,35.2 46.83,35.2 DD2.97
  Top 0.254: DD2.97 47.94,36.34 | 46.1,35.2 44.1,33.2 44.1,29.4 48.6,24.9 51.3,24.9 52,24.1 52,21.85 arc90 53.55,20.3 61.2,20.3 65,24.1 78.3,24.1 80.4,22 82.6,22 83.5,21.1 84.75,21.1 v85.3,20.5 | v92.1,21 v92.1,18.9
  Bottom 0.254: v85.3,20.5 85.7,20 90.2,20 91.2,21 v92.1,21 | JP2.4 92.54,17.26 92.1,17.7 v92.1,18.9
I2C_SCL  (via drill 0.6)
  Top 0.25: R81.1 64,7 | 84.5,6 84.1,5.6 82.33,5.6 IC1.6 82.3,5.7 80.6,5.7 | 91,9 91,21.85 90,22.85 v90,23.5 v90,33.5 U44.6 v90,58 90,59.15 89.3,59.75 85,59.75 84.45,59.2 77.65,59.2 76.9,58.45 72.05,58.45 v71.5,59 | v54.86,59.05 54.89,58.27 54,57.54 | 54,55.09 DD2.47
  Top 0.254: DD2.47 | 54,57.54 54,55.09 | 80.6,5.7 76.45,5.7 v76.4,5.75 65.25,5.75 64,7 | 84.5,6 86.5,8 90,8 91,9
  Bottom 0.22: U3.7 90.27,24.1 90.27,23.77 v90,23.5 89.4,24.1
  Bottom 0.25: v90,58 U44.6 | R28.1 70.75,59.75 v71.5,59 73.5,57 R73.1 | 55.73,60 v54.86,59.05
  Bottom 0.254: 55.73,60 66.1,60 66.8,59.3 69.13,59.3 R28.1 | U1.23 87.85,32.25 89.1,33.5 v90,33.5 | 89.4,24.1 89.2,24.3 88.2,24.3 87.8,24.7 arc90 87.75,24.75 DD3.1 | v76.4,5.75 74.3,5.75 72.3,7.75 72.3,8.94 U2.2
I2C_SDA  (via drill 0.6)
  Top 0.25: 80.59,6.91 IC1.5 | R80.1 62,12 | v91,46.5 91,57.2 v91.8,58 91.8,59.75 91.25,60.3 84.8,60.3 84.2,59.7 82.7,59.7 82.4,60 76.55,60 v76,59.5 | 88.9,32 v88.9,21.95 88.95,22 89.5,22 90.3,21.2 90.3,9.49 | 53.53,55.34 53.53,55.33 DD2.48
  Top 0.254: DD2.48 52.57,54.38 | 53.53,55.34 53.53,58.87 v53.3,59.25 | v88.9,46.5 88.9,32 v88.9,31.5 | 80.59,6.91 76.8,6.91 v76.4,7.3 66.7,7.3 62,12 | IC1.5 84.2,6.91 86.3,9 89.81,9 90.3,9.49
  Bottom 0.22: U3.6 91.7,23.7 91.5,23.5 91.5,23 90,21.5 89.35,21.5 v88.9,21.95
  Bottom 0.25: U44.7 91.26,56.08 | U44.7 91.5,56.3 | U44.7 91.27,57.47 v91.8,58 | v88.9,46.5 v91,46.5 | R27.1 67.96,60.5 72,60.5 75.46,57.04 R74.1 76,57.27 v76,59.5 | 84.25,31.75 U1.24 | DD3.16 84.25,26.85 v88.9,31.5
  Bottom 0.254: R27.1 67.3,60.5 54.5,60.5 53.3,59.3 v53.3,59.25 | 84.25,31.75 88.65,31.75 v88.9,31.5 | v76.4,7.3 74.2,7.3 73,8.5 73,8.88 U2.1
ITG-3200_INT  (via drill 0.6)
  Top 0.25: 60.53,57.38 DD2.41
  Top 0.254: v60.5,58.5 60.53,57.38 | v74.5,49 75,49.5 78.6,49.5 80.1,48 80.1,40.9 v78.6,39.4
  Bottom 0.25: v74.5,49 74.5,51 71.9,53.6 71.9,55 69.9,57 65.9,57 65.3,57.5 65.3,58.3 64.6,58.9 60.9,58.9 v60.5,58.5
  Bottom 0.254: R69.2 73.6,36.6 76,39 78.2,39 v78.6,39.4
LED_B
  Top 0.25: 46.1,26.6 47.9,24.8 47.9,24.37 R31.2
  Top 0.254: DD2.95 43.6,33.38 43.6,29.1 46.1,26.6
LED_G
  Top 0.25: R60.2 42,31.52 42,33.19
  Top 0.254: 42,33.19 DD2.93
LED_R  (via drill 0.6)
  Top 0.25: R30.2 49.81,16.29 50.03,16.51 v50.03,16.93 | v35.7,22 37.7,20 44.7,20 45,20.3 v45,21.4
  Top 0.254: DD2.92 40,31.9 v40,31.51
  Bottom 0.25: 50.03,17.26 v50.03,16.93 50,16.96 50,21 49.6,21.4 v45,21.4 | v40,31.51 36.66,31.51 arc45 36.06,31.26 35.74,30.94 arc45 35.2,29.64 35.2,22.5 v35.7,22
MAG_INT  (via drill 0.6)
  Top 0.25: DD2.38 62.67,57.4
  Top 0.254: v72.25,49.5 72.6,50 73.6,50 77.7,54.1 84.95,54.1 86.1,52.95 86.1,51.85 86.2,51.75 86.2,45.7 87.9,44 87.9,39.7 v87.3,39.1 | 62.67,57.4 v64.3,57.4 | v91,31.9 91.2,32.1 91.2,34.2 90.5,34.9 90.5,36.8 v91.1,37.4
  Bottom 0.25: v72.25,49.5 72.25,52.25 71.3,53.2 71.3,54.8 69.7,56.4 65.3,56.4 v64.3,57.4
  Bottom 0.254: R67.1 86.49,27.56 R66.2 86.24,27.64 88.9,30.3 89.4,30.3 v91,31.9 | v91.1,37.4 89,37.4 v87.3,39.1
MAIN_SUPPLY
  Top 0.254: R54.2 69.41,36.86 XP18.2
  Bottom 0.254: R51.1 67.08,35 67.55,35 68.18,34.52 71.75,34.52 XP18.2
MMA8451Q_INT1  (via drill 0.6)
  Top 0.25: 64.7,58.45 65.75,59.5 69.75,59.5 70.05,59.2 70.05,58.55 70.65,57.95 77.15,57.95 77.85,58.65 v86.3,58.65 | 63,58.4 62.96,58.4 DD2.39
  Top 0.254: DD2.39 55.79,51.19 | 63,58.4 64.65,58.4 64.7,58.45
  Bottom 0.25: R72.1 84.24,53.45 85.25,53.45 85.95,54.15 85.95,57.3 86.3,57.65 v86.3,58.65
MMA8451Q_INT2  (via drill 0.6)
  Top 0.25: v66.3,58.3 69.35,58.3 70.25,57.45 77.4,57.45 77.95,58 84.25,58 v84.7,57.55 | 54.52,54.91 DD2.46
  Top 0.254: DD2.46 | 54.52,54.91 54.52,55.94 v55.02,56.57
  Bottom 0.25: v55.02,56.57 55.02,57.52 57,59.5 64.85,59.5 v66.3,58.3 | v84.7,57.55 84.7,56.43 R71.1
N$1
  Top 0.25: 55.6,37.2 DD2.9
  Top 0.254: 55.6,37.2 56.45,36.35 56.45,35.05 60.65,30.85 60.65,29.96 ZQ2.2
  Bottom 0.254: ZQ2.2 61.4,29.35 C9.1
N$2
  Top 0.254: LED2.A R4.2
N$3
  Top 0.254: JP5.2 10.63,5.9 R4.1 R2.1
N$4
  Top 0.25: LED1.A R5.2
N$5
  Top 0.25: 33.4,25.5 34.46,24.44 R3.1
  Top 0.254: 16,5.9 15.55,5.9 JP4.2 | 16,5.9 R5.1 | 33.4,25.5 26.38,25.5 arc45 24.7,24.81 17.98,18.18 arc45 17.6,17.27 17.6,10.1 16,8.5 16,5.9
N$6
  Top 0.25: 55.2,36.9 DD2.8
  Top 0.254: 55.2,36.9 55.95,36.15 55.95,34.85 59.7,31.1 59.7,30.53 ZQ2.1
  Bottom 0.25: C10.1 56.97,27.8 ZQ2.1
N$7
  Top 0.25: 59.1,37.9 57.73,37.9 DD2.13
  Top 0.254: 59.1,37.9 59.3,37.9 65.55,31.65 R6.2
N$8
  Top 0.254: R6.1 67.74,29.76 70.5,27 72.22,27 ZQ1.2 C12.2
N$9
  Top 0.25: 58.95,37.45 57.47,37.45 DD2.12
  Top 0.254: 58.95,37.45 67.55,28.85 67.55,26.85 | 67.55,26.85 ZQ1.1 | 67.55,26.85 C11.2
N$10
  Top 0.254: X1.D- 10.83,44.73 R12.1
N$11  (via drill 0.6)
  Top 0.25: v41.05,17.3 40.5,17.85 38.5,17.85 JP6.3
  Bottom 0.25: BAT1.1 41.05,21.91 v41.05,17.3
N$12
  Top 0.254: L1.2 72.99,47.03 R8.1
N$13
  Top 0.254: X1.D+ 10.67,43.93 R13.1
N$14
  Top 0.254: R10.2 21.08,45.88 Q2.3
N$16
  Top 0.25: R15.1 23.5,51.8 25.2,51.8 25.5,51.5 R16.1
  Top 0.254: Q2.1 22.2,49.33 R15.1
N$17  (via drill 0.6)
  Top 0.305: XP1.19 v2,34
  Bottom 0.25: R22.2 2.18,34 v2,34
N$18  (via drill 0.6)
  Top 0.305: v5.7,30.7 3.97,28.97 XP1.17
  Bottom 0.305: R23.2 5.7,30.72 v5.7,30.7
N$19  (via drill 0.6)
  Top 0.305: v5,22 2.65,22 XP1.11
  Bottom 0.305: R24.2 arc-90 6.12,22 v5,22
N$20
  Bottom 0.254: IC2.4 66.02,33.78 R36.2 68.46,33.78 C45.1
N$21
  Bottom 0.25: C25.1 58.94,13.11 U5.8 | R25.1 59.64,13.23 C25.1 | C25.1 60.11,14.28 C26.A
N$22
  Bottom 0.25: U4.2 76.27,53.5 76.17,53.6 C32.2
N$23
  Bottom 0.25: C36.2 76.35,33.25 U1.10
N$24
  Bottom 0.22: U3.4 C29.2
N$25
  Bottom 0.25: R70.1 74.49,30.16 74.49,35.32 75.3,36.28 R26.1
  Bottom 0.254: R26.1 C38.2
N$26
  Bottom 0.22: U3.1 95.5,25.3 95.6,25.4 95.6,26.2
  Bottom 0.25: 95.6,26.2 C28.2
N$27
  Bottom 0.25: C40.1 77.27,22.77 77.27,21.76 77.56,21.47 82.51,21.47 82.75,21.71 DD3.8
N$28
  Bottom 0.25: DD3.12 80.35,24.75 80.14,24.96 80.14,24.97 79.76,25.35 76.71,25.35 C40.2
N$29
  Top 0.5: X1.VBUS 9.53,45.53 11,47 11,47.95 F1.1
N$30
  Bottom 0.25: U1.20 84.45,33.74 arc-90 C39.2
N$31
  Bottom 0.25: 78.62,19.78 79.25,19.78 R68.2
  Bottom 0.254: C41.A 78.62,19.78
N$32
  Bottom 0.406: XP2.1 93.52,43.55 R29.1
N$33
  Top 0.25: R63.1 46.73,22.17 U$7.G
N$34
  Top 0.25: 55.5,34.45 55.5,35.89 DD2.7
  Top 0.254: 55.5,34.45 56.35,33.6 56.35,33.17 R32.1
N$35
  Bottom 0.25: 64.69,15.25 64.92,15.02 C49.2
  Bottom 0.254: R46.2 64.69,15.25 R48.2
N$36
  Top 0.25: 88.4,55.9 R82.1
  Top 0.254: DD2.32 62.01,52.5 72.5,52.5 76.5,56.5 86,56.5 86.6,55.9 88.4,55.9
N$37
  Bottom 0.254: IC2.3 66.4,36.78 R51.2 68.26,36.78 C45.2
N$38
  Bottom 0.254: R53.1 71.03,47.97 72,47 72.82,47 C43.1
N$39
  Bottom 0.254: 67.46,31.98 R36.1 67.21,31.83 XP18.1
N$40
  Top 0.25: 41.5,59 41.8,59 42.1,58.7 43.9,58.7 44.4,58.2 | 43.9,54.4 43.9,52.44 DD2.62
  Top 0.254: 41.5,59 32.5,59 32,59.5 22.5,59.5 22,60 14.1,60 R39.1 | 43.9,54.4 44.7,55.2 44.7,57.9 44.4,58.2
N$41
  Top 0.25: 42,59.5 42.1,59.5 42.4,59.2 44.2,59.2 44.6,58.8 | 44.5,54.2 44.5,52.54 DD2.61
  Top 0.254: 42,59.5 32.85,59.5 32.35,60 24,60 23.5,60.5 R40.1 | 44.5,54.2 45.2,54.9 45.2,58.2 44.6,58.8
N$42
  Top 0.25: 42.5,60 42.8,59.7 44.5,59.7 44.8,59.4 | 45.1,54 45.1,52.65 DD2.60
  Top 0.254: 42.5,60 34,60 33.5,60.5 R37.1 | 45.1,54 45.7,54.6 45.7,58.5 44.8,59.4
N$43
  Top 0.25: R38.1 44.4,60.6 45,60 | 45.6,53.8 45.6,52.86 DD2.59
  Top 0.254: 45.6,53.8 46.2,54.4 46.2,58.8 45,60
N$44  (via drill 0.6)
  Top 0.254: DA3.4 63.9,19.06 v63.86,19.1
  Bottom 0.254: 63.88,17.58 R46.1 63.86,17.07 v63.86,19.1
N$45
  Top 0.254: DD2.34 61.6,53.5 68.5,53.5 68.8,53.8 R52.1
N$46
  Bottom 0.254: DA2.3 68.15,8.67 68.15,5.95 67.4,5.2 R33.1 67.24,5.14 R45.2
N$47
  Bottom 0.25: R48.1 66.3,15.06 66.3,12.3 65.48,11.48 R47.2
  Bottom 0.254: DA2.1 65.49,11.37 R47.2
N$48
  Bottom 0.254: R35.2 69.32,8.11 R45.1 69.35,6.97 R34.1
N$49
  Top 0.254: DD2.33 61.81,53 70,53 R50.1
N$50
  Top 0.25: 60.25,40.35 58.82,40.35 DD2.18
  Top 0.254: DD2.18 57.91,41.29 | 60.25,40.35 61.65,38.95 62.7,38.95 63.6,39.85 65.6,39.85 66.67,40.92 R49.1
N$51
  Top 0.25: DD2.31 62.22,52
  Top 0.254: DD2.31 58.58,48.38 | R83.1 88.05,53.8 85.8,56.05 76.8,56.05 72.75,52 62.22,52
N$52
  Top 0.25: 59.85,39.4 58.35,39.4 DD2.16
  Top 0.254: DD2.16 | 59.85,39.4 61.25,38 63.2,38 64,38.85 65.95,38.85 66.1,38.7 68.83,38.7 R54.1 70.39,38.66 R56.2
N$53
  Bottom 0.25: C54.1 Q1.1
  Bottom 0.305: C54.1 23.15,46.9 R58.2
N$54
  Top 0.25: 60,39.9 58.56,39.9 DD2.17
  Top 0.254: DD2.17 | 60,39.9 61.4,38.5 62.95,38.5 63.8,39.35 66.26,39.35 66.81,39.9 R55.1 69.96,39.64 R57.2
N$55
  Bottom 0.254: 25.85,39.85 C51.A
  Bottom 0.406: C55.1 C54.2 | C55.1 19,49.3 Q1.3 | C55.1 17,47.5 17,39.5 17.5,39 25,39 25.85,39.85 | C51.A 25.85,41.9 IC3.3
N$56
  Top 0.254: U$7.B 48.13,22.2 R31.1
N$57
  Top 0.254: U$7.R 46.73,16.37 R30.1
N$58
  Top 0.25: 62.5,51.5 62.43,51.5 DD2.30
  Top 0.254: R84.1 88.3,51.7 87.6,52.4 87.6,53.55 85.6,55.55 77,55.55 72.95,51.5 62.5,51.5
N$59
  Bottom 0.25: R61.1 35.36,55.36 35.36,54.26 31.1,50 30,50 29.17,49.17 T3.1
N$60
  Top 0.25: DD2.29 62.63,51
  Top 0.254: DD2.29 59.29,47.69 | R85.1 88.55,49.6 87.7,50.45 87.7,51.6 87.1,52.25 87.1,53.4 85.4,55.1 77.3,55.1 73.2,51 62.63,51
N$61
  Top 0.25: DD2.45 56,55.68
  Top 0.254: 56,55.68 56,60.2 arc90 55.6,60.6 R44.1
N$62
  Top 0.25: 56.6,55.55 56.58,55.55 DD2.44
  Top 0.254: DD2.44 54.01,52.96 | 56.6,55.55 56.6,60.16 arc-90 57.04,60.6 63.4,60.6 R43.1
N$63
  Top 0.25: DD2.42 59.37,56.93
  Top 0.254: R42.1 65.2,60.6 64.23,59.63 60.08,59.63 arc90 59.37,58.92 59.37,56.93
N$64
  Top 0.25: DD2.40 62.86,59
  Top 0.254: R41.1 75.1,60.6 74.2,59.7 72.8,59.7 72.5,60 65.5,60 64.5,59 62.86,59
N$65
  Bottom 0.22: U3.9 90.85,24.9 90.7,25.05
  Bottom 0.25: 90.7,25.05 R67.2
N$66
  Bottom 0.25: DD3.15 83.74,26.62
  Bottom 0.254: 83.74,26.62 83.74,27.61 R66.1
N$67
  Bottom 0.25: DD3.10 80.25,23.75 79.54,23.04 R68.1
N$68
  Bottom 0.25: U1.12 78.98,34.23 76.35,34.23 75.76,34.77 R69.1
N$69
  Bottom 0.25: R70.2 77.8,30.65 77.8,32.02 78.03,32.25 U1.8
N$70
  Bottom 0.25: U4.9 81.47,55 R71.2
N$71
  Bottom 0.25: R72.2 82.13,54.01 82.12,54 U4.11
N$72
  Bottom 0.25: U4.6 78.5,56.5 77.96,57.04 R74.2
N$73
  Bottom 0.25: R73.2 73.6,54.5 U4.4
N$74
  Bottom 0.25: R75.2 U44.2
N$75
  Top 0.25: R62.2 26.55,50.7 R15.2
N$76
  Top 0.25: R63.2 47,24.3 47,25 42.44,29.57 R60.1
N$77
  Top 0.25: R78.2 8.9,18.23 arc-45 8.66,17.66 8.54,17.55 arc-45 7.23,17 7.1,17 R19.1 2.63,16.9 XP1.7
N$78
  Bottom 0.61: 13.3,61.05 13.3,61.5 R64.1
  Bottom 1.676: 21,64.15 13.55,64.15 arc90 13.35,63.95 13.3,61.05 14.98,58.72 XP17.3 | 21,64.15 31,64.15 | 31,64.15 41,64.15 | 41,64.15 51,64.15 | 51,64.15 61,64.15 | 61,64.15 71,64.15 | 71,64.15 81,64.15 | 81,64.15 91.1,64.15 91.08,64.13 XP12.3 | XP13.3 81,62.08 81,64.15 | XP14.3 71,62.08 71,64.15 | XP15.3 61,62.08 61,64.15 | XP8.3 51,62.08 51,64.15 | XP9.3 41,62.08 41,64.15 | XP10.3 31,62 31,64.15 | XP11.3 21,62.08 21,64.15
N$79  (via drill 0.6)
  Top 0.25: v55.9,12 R80.2
  Bottom 0.25: U5.6 57.7,10.85 57.7,11.8 57.5,12 v55.9,12
N$80  (via drill 0.6)
  Top 0.254: v54.45,11 58.1,11 R81.2
  Bottom 0.25: U5.5 56.77,11 v54.45,11
N$81
  Top 0.254: DD2.73 39.75,48.8 C23.2
N$82
  Top 0.25: 53.1,55.6 53.09,55.6 DD2.49
  Top 0.254: DD2.49 | 53.1,55.6 53.1,56.25 R76.2 51.18,58.17 C44.2
N$83
  Top 0.25: 60.4,40.9 58.97,40.9 DD2.19
  Top 0.254: DD2.19 58.26,41.64 | 60.4,40.9 61.8,39.5 62.5,39.5 63.45,40.4 65.45,40.4 66.75,41.7 66.75,43.5 R77.2 R79.2
NET$1
  Bottom 0.25: R58.1 T3.3
  Bottom 0.305: 25.45,47.3 R58.1 25.25,49.25 R59.2
PWM1
  Top 0.305: R38.2 45.6,62.4 XP8.1
PWM2
  Top 0.305: R37.2 35.6,62.4 XP9.1
PWM3
  Top 0.305: R40.2 25.6,62.4 XP10.1
PWM4
  Top 0.305: R39.2 15.5,62.5 XP11.1
PWM5
  Top 0.305: R41.2 85.6,62.4 XP12.1
PWM6
  Top 0.305: R42.2 75.6,62.4 XP13.1
PWM7
  Top 0.305: R43.2 65.7,62.3 XP14.1
PWM8
  Top 0.305: R44.2 55.6,62.4 XP15.1
RECEIVER_PPM  (via drill 0.6)  (1 unrouted)
  Top 0.25: 73.4,50.5 70.5,50.5 v70,50 | 62.9,54 66.1,54 v66.6,54.5
  Top 0.254: 57.21,49.78 DD2.35 61.39,54 62.9,54 | v87.2,48.95 87.2,51.35 86.6,51.95 86.6,53.15 85.15,54.6 77.5,54.6 73.4,50.5
  Bottom 0.25: 92.05,48.9 R29.2 | v70,50 70,53 68.5,54.5 66.5,54.5
  Bottom 0.254: VD8.C 94.04,47.43 R29.2 | 92.05,48.9 87.25,48.9 v87.2,48.95
RESET  (via drill 0.6)
  Top 0.25: 16.37,12.5 S2.S | v6,27 2.57,27 arc90 XP1.15 | v50,23.5 49.6,23.1 44.8,23.1 44,22.3 44,20.8 43.7,20.5 38.1,20.5 36.9,21.7 36.9,23 33.9,26 | 59.5,38.4 57.94,38.4 DD2.14
  Top 0.254: DD2.14 56.46,39.84 56.51,39.84 | 33.9,26 26.17,26 arc45 24.34,25.25 17.56,18.56 arc45 17,17.21 17,13.13 16.37,12.5 v14.15,12.5 | 59.5,38.4 61.4,36.5 v62.45,36.5
  Bottom 0.25: v14.15,12.5 14.35,12.95 R7.1 14.29,15.25 C13.1 11,17.2 11,25 9,27 v6,27
  Bottom 0.254: v50,23.5 50.25,23.5 55.6,28.8 56.4,28.8 56.7,29.1 56.7,30.2 62.45,35.95 v62.45,36.5
SDIO_CK  (via drill 0.6)
  Top 0.25: DD1.5 arc-45 26.49,12.09 29.38,14.98 arc45 30.2,16.95 30.2,18.51 arc-45 30.54,19.34 31.37,20.16 31.37,20.27 v31.35,20.29 | v37.34,36.32 37.34,37.32 arc-45 37.63,38.01 DD2.80
  Bottom 0.25: 33.02,26.42 33.02,29.62 arc-45 34.17,32.39 37.03,35.26 arc45 37.34,35.99 v37.34,36.32
  Bottom 0.254: 33.02,26.42 33,26.4 33,21.41 arc-45 32.71,20.71 32.51,20.51 arc-45 31.97,20.29 v31.35,20.29
SDIO_CMD  (via drill 0.6)
  Top 0.25: v38.99,36.58 38.99,36.82 arc-45 39.29,37.56 DD2.83 | DD1.3 26.53,7.28 arc-45 29.39,14.19 30.09,14.88 arc45 31.2,17.58 v31.2,18.1
  Bottom 0.254: v38.99,36.58 38.99,36.54 arc-45 38.56,35.51 38.48,35.43 arc-45 37.93,35.2 arc45 37.63,35.08 34.51,31.96 arc45 33.55,29.64 33.55,21.26 arc-45 33.08,20.13 31.2,18.25 v31.2,18.1
SDIO_D0  (via drill 0.6)
  Top 0.25: DD1.7 arc-45 23.23,9.53 28.9,15.2 arc45 29.6,16.88 | 43.4,54.7 43.4,51.08 arc45 43.58,50.63 DD2.65
  Top 0.254: v43.4,57.4 43.4,54.7 | v29,24 29.36,24 arc-90 30,23.36 30,21.58 arc-45 29.6,20.61 29.6,16.88
  Bottom 0.25: v43.4,57.4 40.78,57.44 arc46 39.53,56.93 33.05,50.45 arc45 31.8,47.43 31.8,34.36 arc-45 31.26,33.06 arc45 30.4,30.98 30.4,26.45 arc-45 29.94,25.34 29,24.4 v29,24
SDIO_D1  (via drill 0.6)
  Top 0.25: DD1.8 arc-45 21.85,8.85 28.5,15.5 arc45 29,16.71 v29,22.4 | 42.8,54.6 42.8,51.22 arc45 43.16,50.35 DD2.66
  Top 0.254: v42,56.4 42.24,56.16 arc-45 42.8,54.81 42.8,54.6
  Bottom 0.25: v29,22.4 29.65,22.85 arc55 30,23.53 30,24.17 arc-45 30.31,24.91 arc45 30.9,26.34 30.9,30.65 arc-45 31.85,32.95 arc45 32.3,34.03 32.3,47.36 arc-45 33.46,50.16
  Bottom 0.254: 33.46,50.16 39.14,55.84 arc-45 40.49,56.4 v42,56.4
SDIO_D2  (via drill 0.6)
  Top 0.25: v34.16,34.92 34.16,35.62 arc-45 34.41,36.21 DD2.78 | DD1.1 28.73,9.66 arc-45 30.34,13.54 31.69,14.89 arc45 32.89,17.8 32.89,22.61
  Top 0.254: 32.89,22.61 arc90 31.89,23.62 v31.52,23.62
  Bottom 0.25: v34.16,34.92 34.16,34.37 arc-45 33.73,33.34 33.11,32.71 arc45 31.9,29.79 31.9,24.1 v31.52,23.62
SDIO_D3  (via drill 0.6)
  Top 0.25: 41.56,42.7 DD2.79 36.13,37.23 arc45 35.69,36.15 v35.69,35.81
  Top 0.254: v31.73,21.85 31.73,21.92 32.26,21.39 arc-45 32.4,21.05 32.4,17.94 arc-45 31.31,15.31 29.94,13.94 arc45 27.7,8.53 27.7,7.34 DD1.2
  Bottom 0.25: 32.48,22.81 32.48,29.49 arc-45 33.81,32.7 35.29,34.18 arc45 35.69,35.13 v35.69,35.81
  Bottom 0.254: v31.73,21.85 32.48,22.81
SDIO_DETECT  (via drill 0.6)
  Top 0.25: 50.55,35.75 50.55,35.95 | DD1.13 23.2,17.24 R1.1 23.77,20 v25,20 | v35.1,17.9 35.8,18.4 44.6,18.4 v45.05,17.95
  Top 0.254: DD2.2 51.4,36.45 51.05,36.45 50.55,35.95 | v51.2,29.7 51.2,34.8 50.55,35.45 50.55,35.75
  Bottom 0.25: v51.2,29.7 50,28.3 50,27.3 47.4,24.7 46.2,24.7 45.8,25.1 44.2,25.1 43.9,24.75 43.9,19.1 v45.05,17.95 | v35.1,17.9 35.1,14.9 34.2,14 26,14 25,15 v25,20
SPI_EXT_MISO
  Top 0.25: XP7.2 97.93,53.8 R83.2
SPI_EXT_MOSI
  Top 0.25: R82.2 92.15,56 97,56 97.08,56.08 XP7.1
SPI_EXT_NSS
  Top 0.25: 96.44,48.46 95.3,49.6 R85.2
  Top 0.254: 96.44,48.46 XP7.4
SPI_EXT_SCK
  Top 0.25: XP7.3 97.49,51.7 R84.2
TACHOMETER  (via drill 0.6)  (1 unrouted)
  Top 0.25: v29.4,29.7 36.65,29.7 37.05,30.05 v37.6,30.05 | DD2.36 56.83,50.13 61.2,54.5 64,54.5 64.5,55 v64.5,55.4
  Top 0.254: XP16.1 43.53,6.47 42.45,7.55 v42.45,14.1
  Bottom 0.25: 54.35,55.5 56.05,55.5 v57.65,57.1 62.8,57.1 64.4,55.5 64.5,55.5 | v29.4,29.7 29.4,31.29 arc-45 29.87,32.42 30.65,33.2 arc45 31.3,34.77 31.3,47.52 arc-45 32.67,50.82 41.45,59.6 | v37.6,30.05 38.95,30.05 40.5,28.5 40.5,27.5 42.45,25.65
  Bottom 0.254: 54.35,55.5 50.25,59.6 41.45,59.6 | v42.45,14.1 42.45,25.65
TCK
  Top 0.25: XP1.9 2.19,19 4,19 4.9,19.9 R20.1 15.5,19.9 arc45 17.52,20.74 DD2.76
TDI
  Top 0.25: R18.1 7.63,13.9 arc45 8.43,14.23 arc45 8.7,14.88 8.7,15.99 arc-45 9.34,17.54 10.61,18.81 arc-45 12.03,19.4 15.5,19.4 arc45 17.88,20.38 DD2.77
  Top 0.254: R18.1 2.17,13.9 XP1.5
TDO
  Top 0.25: DD2.89 45.99,40.01 arc45 46.1,40.28 46.1,40.33 arc45 45.98,40.62 41.92,44.68 arc45 41.38,44.9 41.32,44.9 arc45 40.77,44.67 39.49,43.39 arc-45 38.07,43 36.66,43.1 arc90 35.8,42.03 arc-45 34.65,39.24 22.27,26.88 arc-45 17.75,25 7.4,25 | 3.89,23.89 XP1.13 4.89,23.89 arc45 6.25,24.45 R21.1 | R21.1 7.4,25 | R21.1 7.28,25.3 | R21.1 arc90 7.4,25
TMS  (via drill 0.6)
  Top 0.25: R78.1 10.5,20.8 10.9,20.4 15.59,20.4 arc45 17.15,21.05 36.88,40.78 arc45 37,41.08 v37,42 | 41.61,47.69 DD2.72 39.39,49.88 arc45 38.12,50.4 v37.8,50.4
  Bottom 0.254: v37.8,50.4 37.02,50.4 arc45 36.3,50.1 35.01,48.81 arc45 34.3,47.1 34.3,46.64 arc45 35.1,44.7 37,42.8 v37,42
TO_GPS  (via drill 0.6)
  Top 0.25: 97,17.26 JP2.3
  Top 0.254: v81.4,20.2 80.3,20.2 77.5,23 65.7,23 61.7,19 34.2,19 v34.1,19.45 | 97,17.26 96.26,17.26 v94,15 | v40.6,54 41.14,53.46 arc-45 41.7,52.1 41.7,51.38 arc45 42.4,49.7 DD2.68
  Bottom 0.25: 33.3,47.16 arc-45 34.32,49.62 38.22,53.52 arc-45 39.38,54 v40.6,54
  Bottom 0.254: v81.4,20.2 81.8,20.2 83,19 90,19 v94,15 | v34.1,19.45 34.1,29.65 arc-45 34.95,31.69 37.72,34.42 arc-45 38.15,34.6 38.43,34.6 arc45 39.06,34.86 40.21,36.01 arc45 40.3,36.23 40.3,37.02 arc90 39.31,38 35.94,38 arc-90 33.3,40.64 33.3,47.16
TO_XBEE  (via drill 0.6)
  Top 0.254: DD2.25 62.02,43.77 v62.05,43.8 | 97.63,38.5 JP1.3 97.73,38.4 v94.9,38.4
  Bottom 0.254: 62.09,43.84 v62.05,43.8 62.15,43.7 63.05,43 65.05,43 65.35,42.75 65.35,41.85 65.65,41.5 90,41.5 90.4,41.1 92.9,41.1 94.5,39.5 94.5,38.8 v94.9,38.4
TRST
  Top 0.25: R17.1 7.2,10.9 arc90 8.2,11.9 8.2,12.89 arc-45 8.49,13.49 8.74,13.74 arc45 9.3,15.09 9.3,16.25 arc-45 9.69,17.18 11.02,18.52 arc-45 11.94,18.9 15.58,18.9 arc45 18.34,20.04 23.8,25.5 arc-45 26.21,26.5 39.7,26.5 arc90 40.2,27 40.2,29.35 40.2,29.5 39,30.7 39,32.32 DD2.90
  Top 0.254: R17.1 2.29,10.9 XP1.3
USB_DISCOVERY  (via drill 0.6)
  Top 0.25: v44.96,24.13 45.72,24.89 45.72,25.53 43.05,28.19 v41.78,28.19 | v53.01,32.99 53.5,33.28 53.5,35.06 DD2.3 | v34.8,42.6 31.6,42.6 29.7,44.5 29.7,50.15 R62.1
  Top 0.254: DD2.3 52.57,35.98
  Bottom 0.25: 41.4,35.98 arc-45 41.27,35.67 arc45 41,35.02 41,29.1 41.53,28.49 v41.78,28.19 | v44.96,24.13 47.53,24.13 50.6,27.2 50.6,28.15 50.95,28.5 51.95,28.5 53.13,29.68 53.13,32.87 v53.01,32.99
  Bottom 0.254: 41.4,35.98 41.4,36.98 arc90 39.38,39 36.1,39 arc-90 34.8,40.3 v34.8,42.6
USB_DM
  Top 0.25: 13,44.9 13.5,44.9 arc-81 14.2,44.3 arc89 14.75,43.83 17.6,43.83 C16.2 20.58,44.1 arc45 21.64,44.54 22.6,45.5 arc-45 23.8,46 26,46 arc90 28.5,48.5 28.5,52.3 | 36.09,54.59 DD2.70
  Top 0.254: R12.2 13,44.9 | 28.5,52.3 28.5,52.31 28.5,53.88 arc-90 30.62,56 33.77,56 arc-45 35.32,55.36 36.09,54.59
USB_DP
  Top 0.25: R13.2 13.2,43.2 17.5,43.2 17.8,42.9 C17.2 18.3,42.9 18.6,43.2 20,43.2 20.1,43.2 | 35.68,54.29 DD2.71 | 20.28,43.1 arc45 21.34,43.54 23.04,45.24 arc-45 23.67,45.5 25.9,45.5 arc90 29,48.6 29,52.3
  Top 0.254: 35.68,54.29 34.96,55.01 arc45 33.66,55.55 30.84,55.55 arc90 29,53.71 29,52.3 | 20.28,43.1 20.2,43.1 R10.1 20,43.2
V_IN  (via drill 0.6)
  Top 1.676: 18.5,64.15 10.95,64.15 10.95,60.5 XP17.2 | 18.5,64.15 28.5,64.15 | 28.5,64.15 38.5,64.15 | 38.5,64.15 48.5,64.15 | 48.5,64.15 58.5,64.15 | 58.5,64.15 68.5,64.15 | 68.5,64.15 78.5,64.15 | 78.5,64.15 88.55,64.15 88.54,64.14 XP12.2 | XP13.2 78.5,62.04 78.5,64.15 | XP14.2 68.5,62.04 68.5,64.15 | XP15.2 58.5,62.04 58.5,64.15 | XP8.2 48.5,62.04 48.5,64.15 | XP9.2 38.5,62.04 38.5,64.15 | XP10.2 28.5,62.04 28.5,64.15 | XP11.2 18.5,62.04 18.5,64.15
  Bottom 0.61: XP17.2 12.5,58.04 v12.5,55.7 12.5,55.25 F3.1
VBAT  (via drill 0.6)
  Top 0.25: v55.7,29.8 56.6,30.8 56.6,31.7 55,33.3 55,35.68 DD2.6 | JP6.2 38.24,15.1 38.25,15.1 39.45,16.3 44.95,16.3 46.1,15.15 50.45,15.15 v50.5,15.1
  Top 0.254: DD2.6 53.65,37.05
  Bottom 0.25: v55.7,29.8 55.8,29.8 50.8,24.8 49.3,24.8 48.4,23.9 48.4,23 49.1,22.3 50.7,22.3 51.1,21.9 51.1,15.6 50.6,15.1 v50.5,15.1
VDD_A  (via drill 0.6)  (1 unrouted)
  Top 0.254: DD2.22 59.27,42.7 58.49,43.48 58.49,43.67 59.77,44.95 62.95,44.95 64.1,46.1 65.65,46.1 65.85,46.3 R79.1 67.45,47.55 R8.2 69.84,47.04 C15.1 70.08,45.1 C14.A
  Bottom 0.254: C22.1 IC2.5 62.88,33.28 v61.9,32.3
VREF_MCU  (via drill 0.6)
  Top 0.254: DD2.21 | DD2.21 58.96,42.35 | DD2.21 57.85,43.45 57.85,43.79 59.51,45.45 62.55,45.45 64.27,47.17 v64.89,47.17 | v64.89,47.17 64.91,47.15 | v64.89,47.17 64.92,47.14
  Bottom 0.254: v64.89,47.17 R53.2 66.56,47.92 DA6.5
XBEE_CTS  (via drill 0.6)
  Top 0.25: 61.4,41.3 DD2.23
  Top 0.254: DD2.23 | 61.4,41.3 62.87,41.3 v64.3,41.98
  Bottom 0.254: v64.3,41.98 65.23,40.95 85.5,41 89.7,41 90.2,40.5 92.7,40.5 93.2,40 93.2,37.9 93.7,37.4 97.01,37.4 JP1.4
XBEE_RESET  (via drill 0.6)
  Top 0.25: DD2.1 51.86,35.26 | 52.2,30.99 52.2,28.88 53.2,27.87
  Top 0.254: 53.2,27.87 53.2,21.86 arc90 53.56,21.5 59.82,21.5 arc90 60.4,22.08 60.4,24.72 60.88,25.2 78.6,25.2 80.8,23 83.2,23 84.1,22.1 87.3,22.1 88.25,23.05 88.25,29.95 87.8,30.4 v87.8,34.5 | DD2.1 52.45,34.7 52.45,34.15 51.95,33.65 51.95,31.3 52.2,31.05 52.2,30.99 | JP1.5 97.59,36 97,36 95.7,34.7 v94.8,34.7
  Bottom 0.254: v87.8,34.5 87.9,34.6 94.7,34.6 v94.8,34.7
XBEE_RTS  (via drill 0.6)
  Top 0.25: 61.13,42.29 61.12,42.29 DD2.24
  Top 0.254: DD2.24 | 61.13,42.29 v62.11,42.29
  Bottom 0.254: v62.11,42.29 62.11,42.19 63.8,40.5 89.4,40.5 90,39.9 92.4,39.9 92.6,39.7 92.6,36.3 93.2,35.7 97.85,35.7 JP1.6
XBEE_SLEEP  (via drill 0.6)
  Top 0.25: 46.3,34.7 47.04,34.7 DD2.98
  Top 0.254: DD2.98 48.29,35.99 | 46.3,34.7 44.6,33 44.6,29.7 48.9,25.4 51.5,25.4 52.6,24.2 52.6,21.86 arc90 53.56,20.9 60.39,20.9 61,21.51 61,24.23 arc-90 61.47,24.7 78.4,24.7 80.6,22.5 83,22.5 83.9,21.6 86.2,21.6 v86.85,21 | JP1.9 97.87,23.32 v96.4,21.85
  Bottom 0.254: v86.85,21 90.3,21 91.4,22.1 96.15,22.1 v96.4,21.85